# EAGLE schematic CEM-3310-VCADSR-MB (EAGLE 9.6.2)
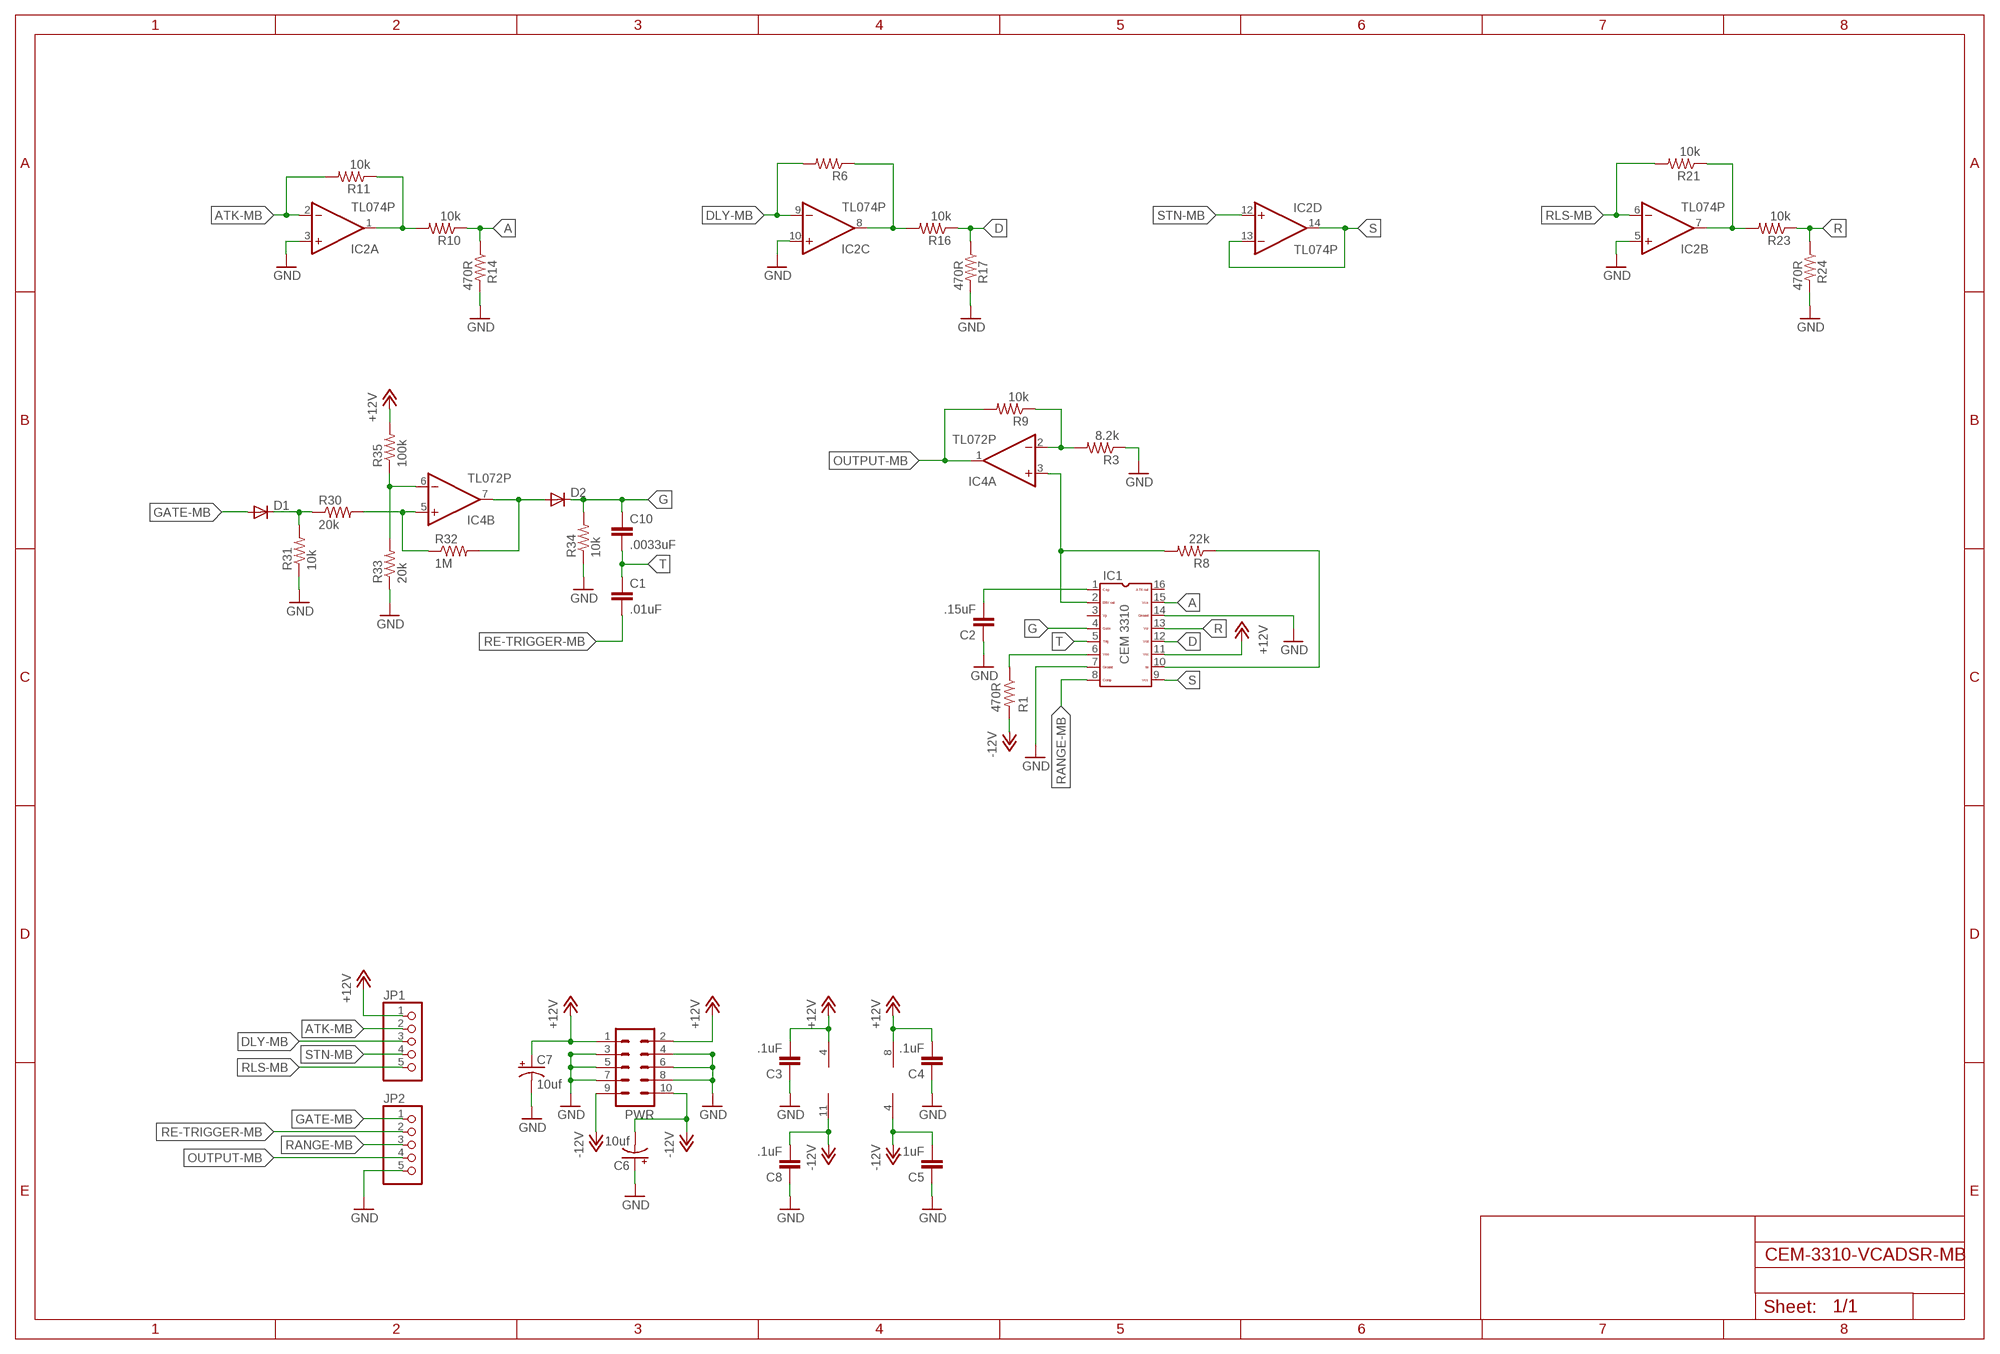
[diagram p0: schematic, sheet 1]

## Parts
C1  .01uF  C-EU050-024X044  [C050-024X044]
C2  .15uF  C-EU050-024X044  [C050-024X044]
C3  .1uF  C-EU050-024X044  [C050-024X044]
C4  .1uF  C-EU050-024X044  [C050-024X044]
C5  .1uF  C-EU050-024X044  [C050-024X044]
C6  10uf  CPOL-USE2.5-5  [E2,5-5]
C7  10uf  CPOL-USE2.5-5  [E2,5-5]
C8  .1uF  C-EU050-024X044  [C050-024X044]
C10  .0033uF  C-EU050-024X044  [C050-024X044]
D1  1N4148DO35-7  [DO35-7]
D2  1N4148DO35-7  [DO35-7]
IC1  CEM3310  [DIL16]
IC2  TL074P  [DIL14]
IC4  TL072P  [DIL08]
JP1  PINHD-1X5  [1X05]
JP2  PINHD-1X5  [1X05]
PWR  ML10  [ML10]
R1  470R  R-US_0207/7  [0207/7]
R3  8.2k  R-US_0207/7  [0207/7]
R6  10k  R-US_0207/7  [0207/7]
R8  22k  R-US_0207/7  [0207/7]
R9  10k  R-US_0207/7  [0207/7]
R10  10k  R-US_0207/7  [0207/7]
R11  10k  R-US_0207/7  [0207/7]
R14  470R  R-US_0207/7  [0207/7]
R16  10k  R-US_0207/7  [0207/7]
R17  470R  R-US_0207/7  [0207/7]
R21  10k  R-US_0207/7  [0207/7]
R23  10k  R-US_0207/7  [0207/7]
R24  470R  R-US_0207/7  [0207/7]
R30  20k  R-US_0207/7  [0207/7]
R31  10k  R-US_0207/7  [0207/7]
R32  1M  R-US_0207/7  [0207/7]
R33  20k  R-US_0207/7  [0207/7]
R34  10k  R-US_0207/7  [0207/7]
R35  100k  R-US_0207/7  [0207/7]

## Nets
+12V: C3.2 C4.2 C7.+ IC1.11 IC2.4(P:V+) IC4.8(P:V+) JP1.1 PWR.1 PWR.2 R35.2
-12V: C5.2 C6.- C8.2 IC2.11(P:V-) IC4.4(P:V-) PWR.9 PWR.10 R1.2
A: IC1.15 R10.1 R14.1
ATK-MB: IC2.2(A:-IN) JP1.2 R11.2
D: IC1.12 R16.1 R17.1
DLY-MB: IC2.9(C:-IN) JP1.3 R6.2
G: C10.1 D2.C IC1.4 R34.2
GATE-MB: D1.A JP2.1
GND: C2.1 C3.1 C4.1 C5.1 C6.+ C7.- C8.1 IC1.7 IC1.14 IC2.3(A:+IN) IC2.5(B:+IN) IC2.10(C:+IN) JP2.5 PWR.3 PWR.4 PWR.5 PWR.6 PWR.7 PWR.8 R3.1 R14.2 R17.2 R24.2 R31.1 R33.1 R34.1
N$1: IC1.6 R1.1
N$4: C2.2 IC1.1
N$6: IC2.1(A:OUT) R10.2 R11.1
N$9: D1.C R30.1 R31.2
N$15: IC2.8(C:OUT) R6.1 R16.2
N$19: IC1.2 IC4.3(A:+IN) R8.2
N$21: IC2.7(B:OUT) R21.1 R23.2
N$22: IC4.5(B:+IN) R30.2 R32.1
N$23: IC1.10 R8.1
N$24: IC4.2(A:-IN) R3.2 R9.1
N$29: D2.A IC4.7(B:OUT) R32.2
N$30: IC4.6(B:-IN) R33.2 R35.1
OUTPUT-MB: IC4.1(A:OUT) JP2.4 R9.2
R: IC1.13 R23.1 R24.1
RANGE-MB: IC1.8 JP2.3
RE-TRIGGER-MB: C1.2 JP2.2
RLS-MB: IC2.6(B:-IN) JP1.5 R21.2
S: IC1.9 IC2.13(D:-IN) IC2.14(D:OUT)
STN-MB: IC2.12(D:+IN) JP1.4
T: C1.1 C10.2 IC1.5
Unconnected: IC1.3 IC1.16

## Library data of the parts
C1-C5 C8 C10 = resistor:C-EU: CAPACITOR, European symbol
C6 C7 = resistor:CPOL-US: POLARIZED CAPACITOR, American symbol
D1 D2 = TomW:1N4148: DIODE high speed (Philips)
IC1 = CEM:CEM3310: CEM 3310 VCEG
IC2 = linear:TL074: OP AMP
IC4 = TomW:TL072: OP AMP
JP1 JP2 = pinhead:PINHD-1X5: PIN HEADER
PWR = con-ml:ML10: HARTING; OC_FARNELL: unknown; OC_NEWARK: unknown
R1 R3 R6 R8-R11 R14 R16 R17 R21 R23 R24 R30-R35 = resistor:R-US_: RESISTOR, American symbol